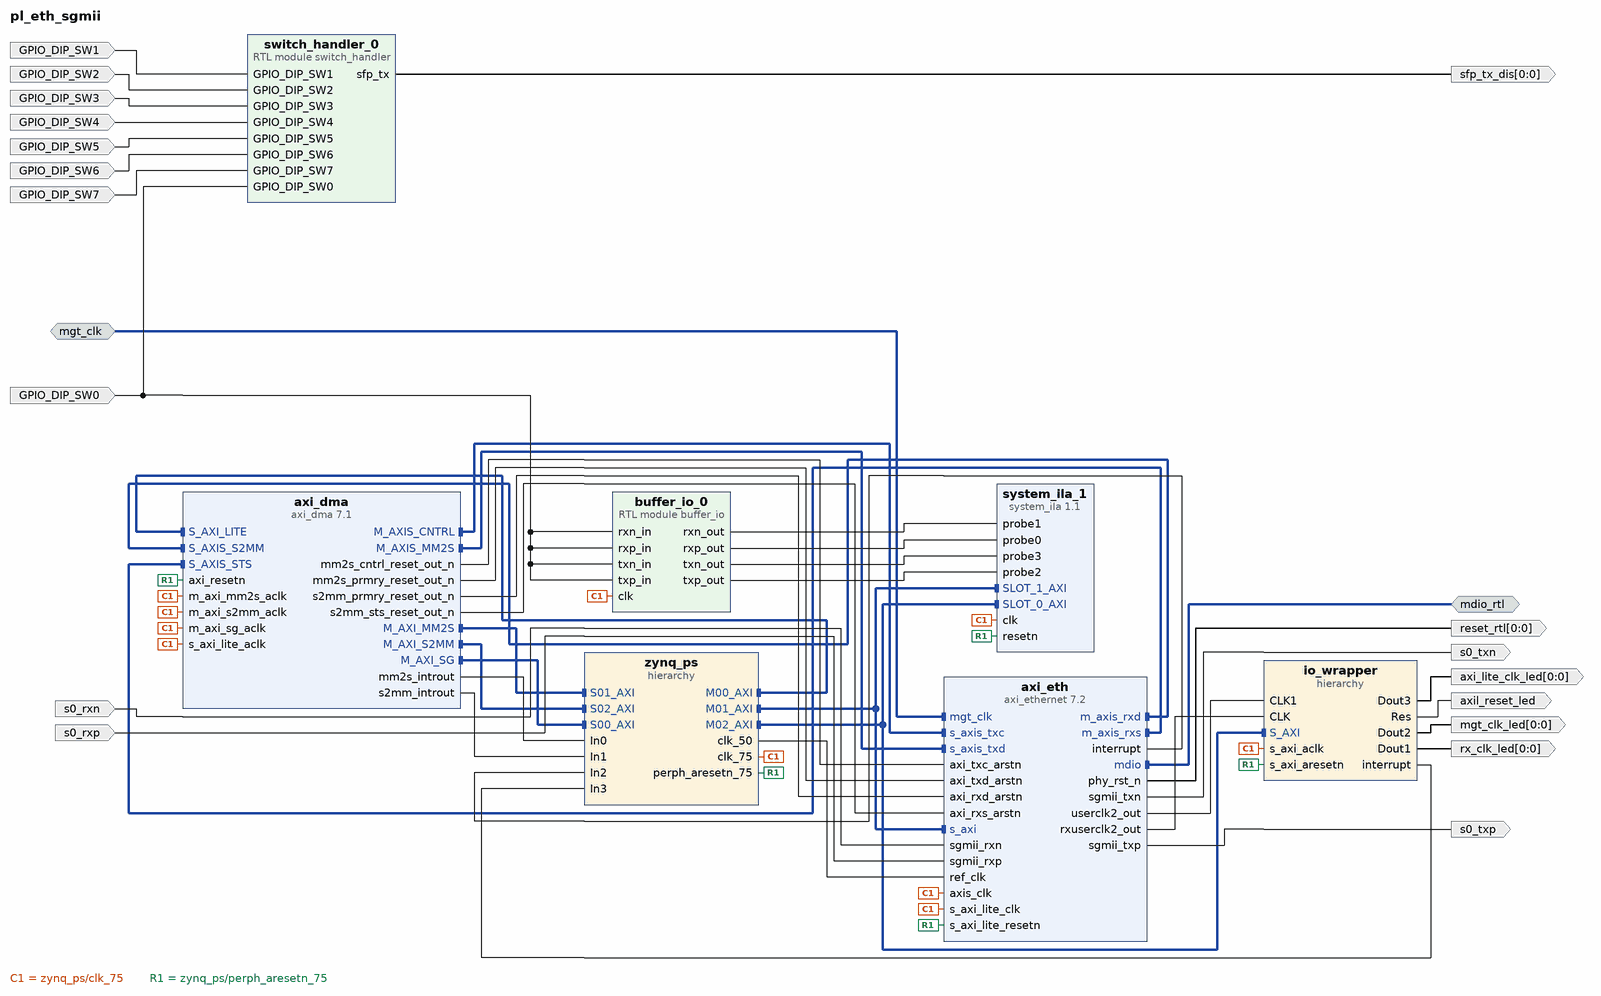
[diagram p0: block diagram of the top level]
# Vivado block design pl_eth_sgmii, xczu9eg-ffvb1156-2-e, Vivado 2022.1
create_bd_design pl_eth_sgmii

create_bd_intf_port -mode Master -vlnv xilinx.com:interface:mdio_rtl:1.0 mdio_rtl
create_bd_intf_port -mode Slave -vlnv xilinx.com:interface:diff_clock_rtl:1.0 mgt_clk
create_bd_port -dir I GPIO_DIP_SW0
create_bd_port -dir I GPIO_DIP_SW1
create_bd_port -dir I GPIO_DIP_SW2
create_bd_port -dir I GPIO_DIP_SW3
create_bd_port -dir I GPIO_DIP_SW4
create_bd_port -dir I GPIO_DIP_SW5
create_bd_port -dir I GPIO_DIP_SW6
create_bd_port -dir I GPIO_DIP_SW7
create_bd_port -dir O -from 0 -to 0 axi_lite_clk_led
create_bd_port -dir O axil_reset_led
create_bd_port -dir O -from 0 -to 0 mgt_clk_led
create_bd_port -dir O -from 0 -to 0 -type rst reset_rtl
create_bd_port -dir O -from 0 -to 0 rx_clk_led
create_bd_port -dir I s0_rxn
create_bd_port -dir I s0_rxp
create_bd_port -dir O s0_txn
create_bd_port -dir O s0_txp
create_bd_port -dir O -from 0 -to 0 sfp_tx_dis

create_bd_cell -type ip -vlnv xilinx.com:ip:axi_dma:7.1 axi_dma
set_property -dict [list \
  CONFIG.c_include_mm2s_dre 1 \
  CONFIG.c_include_s2mm_dre 1 \
  CONFIG.c_sg_length_width 16 \
  CONFIG.c_sg_use_stsapp_length 1 \
] [get_bd_cells axi_dma]
create_bd_cell -type ip -vlnv xilinx.com:ip:axi_ethernet:7.2 axi_eth
set_property -dict [list \
  CONFIG.ENABLE_LVDS false \
  CONFIG.Enable_1588 false \
  CONFIG.PHYADDR 2 \
  CONFIG.PHY_TYPE SGMII \
  CONFIG.RXCSUM Full \
  CONFIG.RXMEM 32k \
  CONFIG.Statistics_Reset true \
  CONFIG.SupportLevel 1 \
  CONFIG.TXCSUM Full \
  CONFIG.TXMEM 32k \
  CONFIG.TransceiverControl false \
  CONFIG.gtlocation X1Y12 \
  CONFIG.gtrefclkrate 156.25 \
  CONFIG.speed_1_2p5 1G \
] [get_bd_cells axi_eth]
create_bd_cell -type module -reference buffer_io buffer_io_0
create_bd_cell -type hier io_wrapper
create_bd_cell -type module -reference switch_handler switch_handler_0
create_bd_cell -type ip -vlnv xilinx.com:ip:system_ila:1.1 system_ila_1
set_property -dict {CONFIG.C_MON_TYPE MIX CONFIG.C_NUM_MONITOR_SLOTS 2 CONFIG.C_NUM_OF_PROBES 4} [get_bd_cells system_ila_1]
create_bd_cell -type hier zynq_ps

# ---- hierarchy /io_wrapper ----
current_bd_instance /io_wrapper
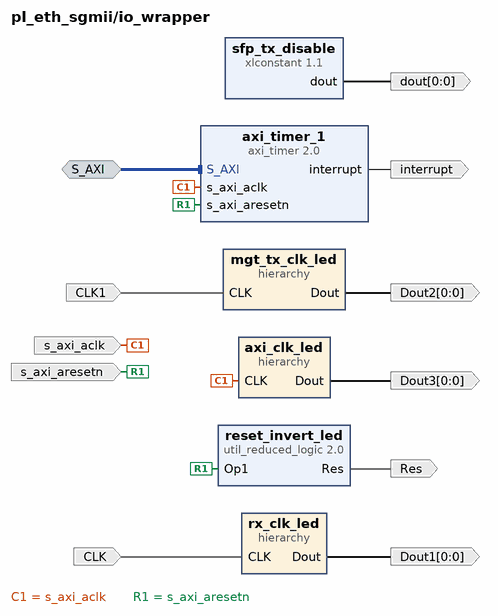
[diagram p1: block diagram inside /io_wrapper]
create_bd_intf_pin -mode Slave -vlnv xilinx.com:interface:aximm_rtl:1.0 S_AXI
create_bd_pin -dir I -type clk CLK
create_bd_pin -dir I -type clk CLK1
create_bd_pin -dir O -from 0 -to 0 Dout1
create_bd_pin -dir O -from 0 -to 0 Dout2
create_bd_pin -dir O -from 0 -to 0 Dout3
create_bd_pin -dir O Res
create_bd_pin -dir O -from 0 -to 0 dout
create_bd_pin -dir O -type intr interrupt
create_bd_pin -dir I -type clk s_axi_aclk
create_bd_pin -dir I -type rst s_axi_aresetn

create_bd_cell -type hier axi_clk_led
create_bd_cell -type ip -vlnv xilinx.com:ip:axi_timer:2.0 axi_timer_1
create_bd_cell -type hier mgt_tx_clk_led
create_bd_cell -type ip -vlnv xilinx.com:ip:util_reduced_logic:2.0 reset_invert_led
set_property -dict {CONFIG.C_SIZE 1} [get_bd_cells reset_invert_led]
create_bd_cell -type hier rx_clk_led
create_bd_cell -type ip -vlnv xilinx.com:ip:xlconstant:1.1 sfp_tx_disable
set_property -dict {CONFIG.CONST_VAL 1 CONFIG.CONST_WIDTH 1} [get_bd_cells sfp_tx_disable]

# ---- hierarchy /io_wrapper/axi_clk_led ----
current_bd_instance /io_wrapper/axi_clk_led
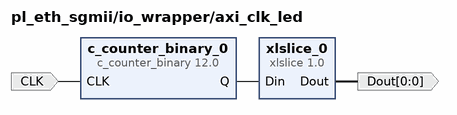
[diagram p2: block diagram inside /io_wrapper/axi_clk_led]
create_bd_pin -dir I -type clk CLK
create_bd_pin -dir O -from 0 -to 0 Dout

create_bd_cell -type ip -vlnv xilinx.com:ip:c_counter_binary:12.0 c_counter_binary_0
set_property -dict {CONFIG.Output_Width 32 CONFIG.Restrict_Count false} [get_bd_cells c_counter_binary_0]
create_bd_cell -type ip -vlnv xilinx.com:ip:xlslice:1.0 xlslice_0
set_property -dict {CONFIG.DIN_FROM 24 CONFIG.DIN_TO 24 CONFIG.DOUT_WIDTH 1} [get_bd_cells xlslice_0]

# ---- hierarchy /io_wrapper/mgt_tx_clk_led ----
current_bd_instance /io_wrapper/mgt_tx_clk_led
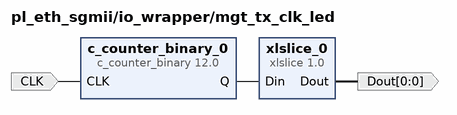
[diagram p3: block diagram inside /io_wrapper/mgt_tx_clk_led]
create_bd_pin -dir I -type clk CLK
create_bd_pin -dir O -from 0 -to 0 Dout

create_bd_cell -type ip -vlnv xilinx.com:ip:c_counter_binary:12.0 c_counter_binary_0
set_property -dict {CONFIG.Output_Width 32 CONFIG.Restrict_Count false} [get_bd_cells c_counter_binary_0]
create_bd_cell -type ip -vlnv xilinx.com:ip:xlslice:1.0 xlslice_0
set_property -dict {CONFIG.DIN_FROM 24 CONFIG.DIN_TO 24 CONFIG.DOUT_WIDTH 1} [get_bd_cells xlslice_0]

# ---- hierarchy /io_wrapper/rx_clk_led ----
current_bd_instance /io_wrapper/rx_clk_led
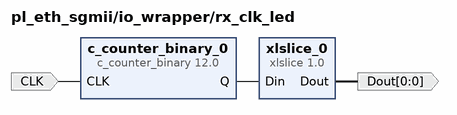
[diagram p4: block diagram inside /io_wrapper/rx_clk_led]
create_bd_pin -dir I -type clk CLK
create_bd_pin -dir O -from 0 -to 0 Dout

create_bd_cell -type ip -vlnv xilinx.com:ip:c_counter_binary:12.0 c_counter_binary_0
set_property -dict {CONFIG.Output_Width 32 CONFIG.Restrict_Count false} [get_bd_cells c_counter_binary_0]
create_bd_cell -type ip -vlnv xilinx.com:ip:xlslice:1.0 xlslice_0
set_property -dict {CONFIG.DIN_FROM 24 CONFIG.DIN_TO 24 CONFIG.DOUT_WIDTH 1} [get_bd_cells xlslice_0]

# ---- hierarchy /zynq_ps ----
current_bd_instance /zynq_ps
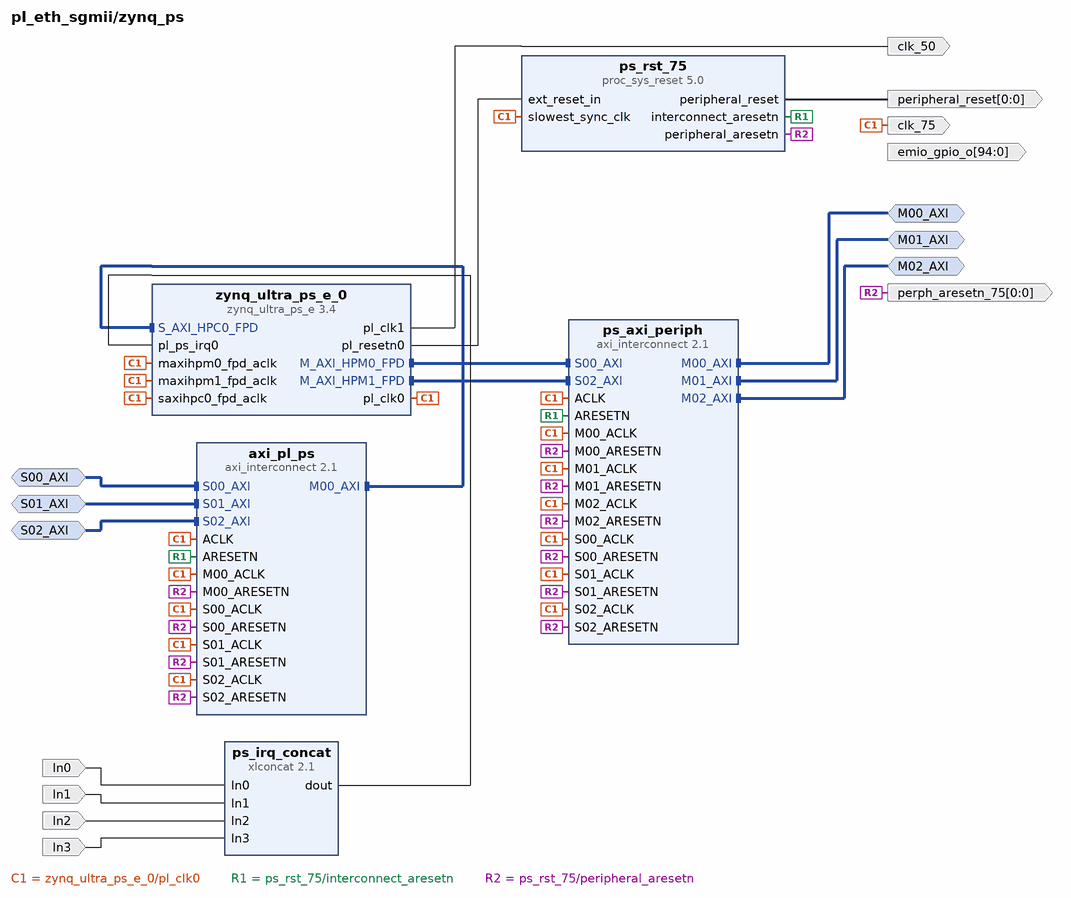
[diagram p5: block diagram inside /zynq_ps]
create_bd_intf_pin -mode Master -vlnv xilinx.com:interface:aximm_rtl:1.0 M00_AXI
create_bd_intf_pin -mode Master -vlnv xilinx.com:interface:aximm_rtl:1.0 M01_AXI
create_bd_intf_pin -mode Master -vlnv xilinx.com:interface:aximm_rtl:1.0 M02_AXI
create_bd_intf_pin -mode Slave -vlnv xilinx.com:interface:aximm_rtl:1.0 S00_AXI
create_bd_intf_pin -mode Slave -vlnv xilinx.com:interface:aximm_rtl:1.0 S01_AXI
create_bd_intf_pin -mode Slave -vlnv xilinx.com:interface:aximm_rtl:1.0 S02_AXI
create_bd_pin -dir I In0
create_bd_pin -dir I In1
create_bd_pin -dir I In2
create_bd_pin -dir I In3
create_bd_pin -dir O -type clk clk_50
create_bd_pin -dir O -type clk clk_75
create_bd_pin -dir O -from 94 -to 0 emio_gpio_o
create_bd_pin -dir O -from 0 -to 0 -type rst peripheral_reset
create_bd_pin -dir O -from 0 -to 0 -type rst perph_aresetn_75

create_bd_cell -type ip -vlnv xilinx.com:ip:axi_interconnect:2.1 axi_pl_ps
set_property -dict [list \
  CONFIG.ENABLE_ADVANCED_OPTIONS 1 \
  CONFIG.NUM_MI 1 \
  CONFIG.NUM_SI 3 \
  CONFIG.XBAR_DATA_WIDTH 32 \
] [get_bd_cells axi_pl_ps]
create_bd_cell -type ip -vlnv xilinx.com:ip:axi_interconnect:2.1 ps_axi_periph
set_property -dict {CONFIG.NUM_MI 3 CONFIG.NUM_SI 3} [get_bd_cells ps_axi_periph]
create_bd_cell -type ip -vlnv xilinx.com:ip:xlconcat:2.1 ps_irq_concat
set_property -dict {CONFIG.NUM_PORTS 4} [get_bd_cells ps_irq_concat]
create_bd_cell -type ip -vlnv xilinx.com:ip:proc_sys_reset:5.0 ps_rst_75
create_bd_cell -type ip -vlnv xilinx.com:ip:zynq_ultra_ps_e:3.4 zynq_ultra_ps_e_0
set_property -dict [list \
  CONFIG.PSU_BANK_0_IO_STANDARD LVCMOS18 \
  CONFIG.PSU_BANK_1_IO_STANDARD LVCMOS18 \
  CONFIG.PSU_BANK_2_IO_STANDARD LVCMOS18 \
  CONFIG.PSU_BANK_3_IO_STANDARD LVCMOS18 \
  CONFIG.PSU_DYNAMIC_DDR_CONFIG_EN 1 \
  CONFIG.PSU_USB3__DUAL_CLOCK_ENABLE 1 \
  CONFIG.PSU__CAN1__PERIPHERAL__ENABLE 1 \
  CONFIG.PSU__CAN1__PERIPHERAL__IO {MIO 24 .. 25} \
  CONFIG.PSU__CRF_APB__ACPU_CTRL__FREQMHZ 1200 \
  CONFIG.PSU__CRF_APB__ACPU_CTRL__SRCSEL APLL \
  CONFIG.PSU__CRF_APB__APLL_CTRL__SRCSEL PSS_REF_CLK \
  CONFIG.PSU__CRF_APB__DBG_FPD_CTRL__FREQMHZ 250 \
  CONFIG.PSU__CRF_APB__DBG_FPD_CTRL__SRCSEL IOPLL \
  CONFIG.PSU__CRF_APB__DBG_TRACE_CTRL__FREQMHZ 250 \
  CONFIG.PSU__CRF_APB__DBG_TRACE_CTRL__SRCSEL IOPLL \
  CONFIG.PSU__CRF_APB__DBG_TSTMP_CTRL__FREQMHZ 250 \
  CONFIG.PSU__CRF_APB__DBG_TSTMP_CTRL__SRCSEL IOPLL \
  CONFIG.PSU__CRF_APB__DDR_CTRL__FREQMHZ 1067 \
  CONFIG.PSU__CRF_APB__DDR_CTRL__SRCSEL DPLL \
  CONFIG.PSU__CRF_APB__DPDMA_REF_CTRL__FREQMHZ 600 \
  CONFIG.PSU__CRF_APB__DPDMA_REF_CTRL__SRCSEL APLL \
  CONFIG.PSU__CRF_APB__DPLL_CTRL__SRCSEL PSS_REF_CLK \
  CONFIG.PSU__CRF_APB__DP_AUDIO_REF_CTRL__SRCSEL RPLL \
  CONFIG.PSU__CRF_APB__DP_STC_REF_CTRL__SRCSEL RPLL \
  CONFIG.PSU__CRF_APB__DP_VIDEO_REF_CTRL__SRCSEL VPLL \
  CONFIG.PSU__CRF_APB__GDMA_REF_CTRL__FREQMHZ 600 \
  CONFIG.PSU__CRF_APB__GDMA_REF_CTRL__SRCSEL APLL \
  CONFIG.PSU__CRF_APB__GPU_REF_CTRL__FREQMHZ 500 \
  CONFIG.PSU__CRF_APB__GPU_REF_CTRL__SRCSEL IOPLL \
  CONFIG.PSU__CRF_APB__TOPSW_LSBUS_CTRL__FREQMHZ 100 \
  CONFIG.PSU__CRF_APB__TOPSW_LSBUS_CTRL__SRCSEL IOPLL \
  CONFIG.PSU__CRF_APB__TOPSW_MAIN_CTRL__FREQMHZ 533.33 \
  CONFIG.PSU__CRF_APB__TOPSW_MAIN_CTRL__SRCSEL DPLL \
  CONFIG.PSU__CRF_APB__VPLL_CTRL__SRCSEL PSS_REF_CLK \
  CONFIG.PSU__CRL_APB__ADMA_REF_CTRL__FREQMHZ 500 \
  CONFIG.PSU__CRL_APB__ADMA_REF_CTRL__SRCSEL IOPLL \
  CONFIG.PSU__CRL_APB__CAN1_REF_CTRL__FREQMHZ 100 \
  CONFIG.PSU__CRL_APB__CAN1_REF_CTRL__SRCSEL IOPLL \
  CONFIG.PSU__CRL_APB__CPU_R5_CTRL__FREQMHZ 500 \
  CONFIG.PSU__CRL_APB__CPU_R5_CTRL__SRCSEL IOPLL \
  CONFIG.PSU__CRL_APB__DBG_LPD_CTRL__FREQMHZ 250 \
  CONFIG.PSU__CRL_APB__DBG_LPD_CTRL__SRCSEL IOPLL \
  CONFIG.PSU__CRL_APB__GEM3_REF_CTRL__FREQMHZ 125 \
  CONFIG.PSU__CRL_APB__GEM3_REF_CTRL__SRCSEL IOPLL \
  CONFIG.PSU__CRL_APB__I2C0_REF_CTRL__FREQMHZ 100 \
  CONFIG.PSU__CRL_APB__I2C0_REF_CTRL__SRCSEL IOPLL \
  CONFIG.PSU__CRL_APB__I2C1_REF_CTRL__FREQMHZ 100 \
  CONFIG.PSU__CRL_APB__I2C1_REF_CTRL__SRCSEL IOPLL \
  CONFIG.PSU__CRL_APB__IOPLL_CTRL__SRCSEL PSS_REF_CLK \
  CONFIG.PSU__CRL_APB__IOU_SWITCH_CTRL__FREQMHZ 250 \
  CONFIG.PSU__CRL_APB__IOU_SWITCH_CTRL__SRCSEL IOPLL \
  CONFIG.PSU__CRL_APB__LPD_LSBUS_CTRL__FREQMHZ 100 \
  CONFIG.PSU__CRL_APB__LPD_LSBUS_CTRL__SRCSEL IOPLL \
  CONFIG.PSU__CRL_APB__LPD_SWITCH_CTRL__FREQMHZ 500 \
  CONFIG.PSU__CRL_APB__LPD_SWITCH_CTRL__SRCSEL IOPLL \
  CONFIG.PSU__CRL_APB__PCAP_CTRL__FREQMHZ 200 \
  CONFIG.PSU__CRL_APB__PCAP_CTRL__SRCSEL IOPLL \
  CONFIG.PSU__CRL_APB__PL0_REF_CTRL__FREQMHZ 100 \
  CONFIG.PSU__CRL_APB__PL0_REF_CTRL__SRCSEL IOPLL \
  CONFIG.PSU__CRL_APB__PL1_REF_CTRL__FREQMHZ 50 \
  CONFIG.PSU__CRL_APB__QSPI_REF_CTRL__FREQMHZ 125 \
  CONFIG.PSU__CRL_APB__QSPI_REF_CTRL__SRCSEL IOPLL \
  CONFIG.PSU__CRL_APB__RPLL_CTRL__SRCSEL PSS_REF_CLK \
  CONFIG.PSU__CRL_APB__SDIO1_REF_CTRL__FREQMHZ 200 \
  CONFIG.PSU__CRL_APB__SDIO1_REF_CTRL__SRCSEL IOPLL \
  CONFIG.PSU__CRL_APB__TIMESTAMP_REF_CTRL__FREQMHZ 100 \
  CONFIG.PSU__CRL_APB__TIMESTAMP_REF_CTRL__SRCSEL IOPLL \
  CONFIG.PSU__CRL_APB__UART0_REF_CTRL__FREQMHZ 100 \
  CONFIG.PSU__CRL_APB__UART0_REF_CTRL__SRCSEL IOPLL \
  CONFIG.PSU__CRL_APB__UART1_REF_CTRL__FREQMHZ 100 \
  CONFIG.PSU__CRL_APB__UART1_REF_CTRL__SRCSEL IOPLL \
  CONFIG.PSU__CRL_APB__USB0_BUS_REF_CTRL__FREQMHZ 250 \
  CONFIG.PSU__CRL_APB__USB0_BUS_REF_CTRL__SRCSEL IOPLL \
  CONFIG.PSU__CRL_APB__USB3_DUAL_REF_CTRL__FREQMHZ 20 \
  CONFIG.PSU__CRL_APB__USB3_DUAL_REF_CTRL__SRCSEL IOPLL \
  CONFIG.PSU__CRL_APB__USB3__ENABLE 1 \
  CONFIG.PSU__CSUPMU__PERIPHERAL__VALID 1 \
  CONFIG.PSU__DDRC__BUS_WIDTH {64 Bit} \
  CONFIG.PSU__DDRC__COMPONENTS UDIMM \
  CONFIG.PSU__DDRC__DEVICE_CAPACITY {4096 MBits} \
  CONFIG.PSU__DDRC__DRAM_WIDTH {8 Bits} \
  CONFIG.PSU__DDRC__ECC Disabled \
  CONFIG.PSU__DDRC__MEMORY_TYPE {DDR 4} \
  CONFIG.PSU__DDRC__SPEED_BIN DDR4_2133P \
  CONFIG.PSU__DDR_HIGH_ADDRESS_GUI_ENABLE 1 \
  CONFIG.PSU__DDR__INTERFACE__FREQMHZ 533.500 \
  CONFIG.PSU__DISPLAYPORT__LANE0__ENABLE 1 \
  CONFIG.PSU__DISPLAYPORT__LANE0__IO {GT Lane1} \
  CONFIG.PSU__DISPLAYPORT__LANE1__ENABLE 0 \
  CONFIG.PSU__DISPLAYPORT__PERIPHERAL__ENABLE 1 \
  CONFIG.PSU__DLL__ISUSED 1 \
  CONFIG.PSU__DPAUX__PERIPHERAL__ENABLE 1 \
  CONFIG.PSU__DPAUX__PERIPHERAL__IO {MIO 27 .. 30} \
  CONFIG.PSU__DP__LANE_SEL {Single Lower} \
  CONFIG.PSU__DP__REF_CLK_FREQ 27 \
  CONFIG.PSU__DP__REF_CLK_SEL {Ref Clk3} \
  CONFIG.PSU__ENET3__FIFO__ENABLE 0 \
  CONFIG.PSU__ENET3__GRP_MDIO__ENABLE 1 \
  CONFIG.PSU__ENET3__GRP_MDIO__IO {MIO 76 .. 77} \
  CONFIG.PSU__ENET3__PERIPHERAL__ENABLE 1 \
  CONFIG.PSU__ENET3__PERIPHERAL__IO {MIO 64 .. 75} \
  CONFIG.PSU__ENET3__PTP__ENABLE 0 \
  CONFIG.PSU__ENET3__TSU__ENABLE 0 \
  CONFIG.PSU__FPGA_PL0_ENABLE 1 \
  CONFIG.PSU__FPGA_PL1_ENABLE 1 \
  CONFIG.PSU__GEM3_COHERENCY 0 \
  CONFIG.PSU__GEM3_ROUTE_THROUGH_FPD 0 \
  CONFIG.PSU__GEM__TSU__ENABLE 0 \
  CONFIG.PSU__GPIO0_MIO__IO {MIO 0 .. 25} \
  CONFIG.PSU__GPIO0_MIO__PERIPHERAL__ENABLE 1 \
  CONFIG.PSU__GPIO1_MIO__IO {MIO 26 .. 51} \
  CONFIG.PSU__GPIO1_MIO__PERIPHERAL__ENABLE 1 \
  CONFIG.PSU__GT__LINK_SPEED HBR \
  CONFIG.PSU__GT__PRE_EMPH_LVL_4 0 \
  CONFIG.PSU__GT__VLT_SWNG_LVL_4 0 \
  CONFIG.PSU__I2C0__PERIPHERAL__ENABLE 1 \
  CONFIG.PSU__I2C0__PERIPHERAL__IO {MIO 14 .. 15} \
  CONFIG.PSU__I2C1__PERIPHERAL__ENABLE 1 \
  CONFIG.PSU__I2C1__PERIPHERAL__IO {MIO 16 .. 17} \
  CONFIG.PSU__IOU_SLCR__IOU_TTC_APB_CLK__TTC0_SEL APB \
  CONFIG.PSU__IOU_SLCR__IOU_TTC_APB_CLK__TTC1_SEL APB \
  CONFIG.PSU__IOU_SLCR__IOU_TTC_APB_CLK__TTC2_SEL APB \
  CONFIG.PSU__IOU_SLCR__IOU_TTC_APB_CLK__TTC3_SEL APB \
  CONFIG.PSU__MAXIGP0__DATA_WIDTH 128 \
  CONFIG.PSU__OVERRIDE__BASIC_CLOCK 0 \
  CONFIG.PSU__PCIE__BAR0_VAL 0x0 \
  CONFIG.PSU__PCIE__BAR1_VAL 0x0 \
  CONFIG.PSU__PCIE__BAR2_VAL 0x0 \
  CONFIG.PSU__PCIE__BAR3_VAL 0x0 \
  CONFIG.PSU__PCIE__BAR4_VAL 0x0 \
  CONFIG.PSU__PCIE__BAR5_VAL 0x0 \
  CONFIG.PSU__PCIE__CLASS_CODE_BASE 0x06 \
  CONFIG.PSU__PCIE__CLASS_CODE_INTERFACE 0x0 \
  CONFIG.PSU__PCIE__CLASS_CODE_SUB 0x4 \
  CONFIG.PSU__PCIE__CLASS_CODE_VALUE 0x60400 \
  CONFIG.PSU__PCIE__CRS_SW_VISIBILITY 1 \
  CONFIG.PSU__PCIE__DEVICE_ID 0xD021 \
  CONFIG.PSU__PCIE__DEVICE_PORT_TYPE {Root Port} \
  CONFIG.PSU__PCIE__EROM_VAL 0x0 \
  CONFIG.PSU__PCIE__LANE0__ENABLE 1 \
  CONFIG.PSU__PCIE__LANE0__IO {GT Lane0} \
  CONFIG.PSU__PCIE__LINK_SPEED {5.0 Gb/s} \
  CONFIG.PSU__PCIE__MAXIMUM_LINK_WIDTH x1 \
  CONFIG.PSU__PCIE__MAX_PAYLOAD_SIZE {256 bytes} \
  CONFIG.PSU__PCIE__PERIPHERAL__ENABLE 1 \
  CONFIG.PSU__PCIE__PERIPHERAL__ENDPOINT_ENABLE 0 \
  CONFIG.PSU__PCIE__PERIPHERAL__ROOTPORT_ENABLE 1 \
  CONFIG.PSU__PCIE__PERIPHERAL__ROOTPORT_IO {MIO 31} \
  CONFIG.PSU__PCIE__REF_CLK_FREQ 100 \
  CONFIG.PSU__PCIE__REF_CLK_SEL {Ref Clk0} \
  CONFIG.PSU__PCIE__REVISION_ID 0x0 \
  CONFIG.PSU__PCIE__SUBSYSTEM_ID 0x7 \
  CONFIG.PSU__PCIE__SUBSYSTEM_VENDOR_ID 0x10EE \
  CONFIG.PSU__PCIE__VENDOR_ID 0x10EE \
  CONFIG.PSU__PMU_COHERENCY 0 \
  CONFIG.PSU__PMU__AIBACK__ENABLE 0 \
  CONFIG.PSU__PMU__EMIO_GPI__ENABLE 0 \
  CONFIG.PSU__PMU__EMIO_GPO__ENABLE 0 \
  CONFIG.PSU__PMU__GPI0__ENABLE 0 \
  CONFIG.PSU__PMU__GPI1__ENABLE 0 \
  CONFIG.PSU__PMU__GPI2__ENABLE 0 \
  CONFIG.PSU__PMU__GPI3__ENABLE 0 \
  CONFIG.PSU__PMU__GPI4__ENABLE 0 \
  CONFIG.PSU__PMU__GPI5__ENABLE 0 \
  CONFIG.PSU__PMU__GPO0__ENABLE 0 \
  CONFIG.PSU__PMU__GPO1__ENABLE 0 \
  CONFIG.PSU__PMU__GPO2__ENABLE 1 \
  CONFIG.PSU__PMU__GPO2__IO {MIO 34} \
  CONFIG.PSU__PMU__GPO2__POLARITY high \
  CONFIG.PSU__PMU__GPO3__ENABLE 0 \
  CONFIG.PSU__PMU__GPO4__ENABLE 0 \
  CONFIG.PSU__PMU__GPO5__ENABLE 0 \
  CONFIG.PSU__PMU__PERIPHERAL__ENABLE 1 \
  CONFIG.PSU__PMU__PLERROR__ENABLE 0 \
  CONFIG.PSU__PRESET_APPLIED 1 \
  CONFIG.PSU__PSS_REF_CLK__FREQMHZ 33.330 \
  CONFIG.PSU__QSPI_COHERENCY 0 \
  CONFIG.PSU__QSPI_ROUTE_THROUGH_FPD 0 \
  CONFIG.PSU__QSPI__GRP_FBCLK__ENABLE 1 \
  CONFIG.PSU__QSPI__GRP_FBCLK__IO {MIO 6} \
  CONFIG.PSU__QSPI__PERIPHERAL__DATA_MODE x4 \
  CONFIG.PSU__QSPI__PERIPHERAL__ENABLE 1 \
  CONFIG.PSU__QSPI__PERIPHERAL__IO {MIO 0 .. 12} \
  CONFIG.PSU__QSPI__PERIPHERAL__MODE {Dual Parallel} \
  CONFIG.PSU__SATA__LANE1__IO {GT Lane3} \
  CONFIG.PSU__SATA__PERIPHERAL__ENABLE 1 \
  CONFIG.PSU__SATA__REF_CLK_FREQ 125 \
  CONFIG.PSU__SATA__REF_CLK_SEL {Ref Clk1} \
  CONFIG.PSU__SD1_COHERENCY 0 \
  CONFIG.PSU__SD1_ROUTE_THROUGH_FPD 0 \
  CONFIG.PSU__SD1__CLK_100_SDR_OTAP_DLY 0x3 \
  CONFIG.PSU__SD1__CLK_200_SDR_OTAP_DLY 0x3 \
  CONFIG.PSU__SD1__CLK_50_DDR_ITAP_DLY 0x3D \
  CONFIG.PSU__SD1__CLK_50_DDR_OTAP_DLY 0x4 \
  CONFIG.PSU__SD1__CLK_50_SDR_ITAP_DLY 0x15 \
  CONFIG.PSU__SD1__CLK_50_SDR_OTAP_DLY 0x5 \
  CONFIG.PSU__SD1__DATA_TRANSFER_MODE 8Bit \
  CONFIG.PSU__SD1__GRP_CD__ENABLE 1 \
  CONFIG.PSU__SD1__GRP_CD__IO {MIO 45} \
  CONFIG.PSU__SD1__GRP_POW__ENABLE 0 \
  CONFIG.PSU__SD1__GRP_WP__ENABLE 1 \
  CONFIG.PSU__SD1__GRP_WP__IO {MIO 44} \
  CONFIG.PSU__SD1__PERIPHERAL__ENABLE 1 \
  CONFIG.PSU__SD1__PERIPHERAL__IO {MIO 39 .. 51} \
  CONFIG.PSU__SD1__SLOT_TYPE {SD 3.0} \
  CONFIG.PSU__SWDT0__CLOCK__ENABLE 0 \
  CONFIG.PSU__SWDT0__PERIPHERAL__ENABLE 1 \
  CONFIG.PSU__SWDT0__RESET__ENABLE 0 \
  CONFIG.PSU__SWDT1__CLOCK__ENABLE 0 \
  CONFIG.PSU__SWDT1__PERIPHERAL__ENABLE 1 \
  CONFIG.PSU__SWDT1__RESET__ENABLE 0 \
  CONFIG.PSU__TSU__BUFG_PORT_PAIR 0 \
  CONFIG.PSU__TTC0__CLOCK__ENABLE 0 \
  CONFIG.PSU__TTC0__PERIPHERAL__ENABLE 1 \
  CONFIG.PSU__TTC0__WAVEOUT__ENABLE 0 \
  CONFIG.PSU__TTC1__CLOCK__ENABLE 0 \
  CONFIG.PSU__TTC1__PERIPHERAL__ENABLE 1 \
  CONFIG.PSU__TTC1__WAVEOUT__ENABLE 0 \
  CONFIG.PSU__TTC2__CLOCK__ENABLE 0 \
  CONFIG.PSU__TTC2__PERIPHERAL__ENABLE 1 \
  CONFIG.PSU__TTC2__WAVEOUT__ENABLE 0 \
  CONFIG.PSU__TTC3__CLOCK__ENABLE 0 \
  CONFIG.PSU__TTC3__PERIPHERAL__ENABLE 1 \
  CONFIG.PSU__TTC3__WAVEOUT__ENABLE 0 \
  CONFIG.PSU__UART0__BAUD_RATE 115200 \
  CONFIG.PSU__UART0__MODEM__ENABLE 0 \
  CONFIG.PSU__UART0__PERIPHERAL__ENABLE 1 \
  CONFIG.PSU__UART0__PERIPHERAL__IO {MIO 18 .. 19} \
  CONFIG.PSU__UART1__BAUD_RATE 115200 \
  CONFIG.PSU__UART1__MODEM__ENABLE 0 \
  CONFIG.PSU__UART1__PERIPHERAL__ENABLE 1 \
  CONFIG.PSU__UART1__PERIPHERAL__IO {MIO 20 .. 21} \
  CONFIG.PSU__USB0_COHERENCY 0 \
  CONFIG.PSU__USB0__PERIPHERAL__ENABLE 1 \
  CONFIG.PSU__USB0__PERIPHERAL__IO {MIO 52 .. 63} \
  CONFIG.PSU__USB0__REF_CLK_FREQ 26 \
  CONFIG.PSU__USB0__REF_CLK_SEL {Ref Clk2} \
  CONFIG.PSU__USB2_0__EMIO__ENABLE 0 \
  CONFIG.PSU__USB3_0__EMIO__ENABLE 0 \
  CONFIG.PSU__USB3_0__PERIPHERAL__ENABLE 1 \
  CONFIG.PSU__USB3_0__PERIPHERAL__IO {GT Lane2} \
  CONFIG.PSU__USB__RESET__MODE {Boot Pin} \
  CONFIG.PSU__USB__RESET__POLARITY {Active Low} \
  CONFIG.PSU__USE__IRQ0 1 \
  CONFIG.PSU__USE__M_AXI_GP0 1 \
  CONFIG.PSU__USE__M_AXI_GP1 1 \
  CONFIG.PSU__USE__M_AXI_GP2 0 \
  CONFIG.PSU__USE__S_AXI_GP0 1 \
] [get_bd_cells zynq_ultra_ps_e_0]
# 117 more settings of zynq_ultra_ps_e_0 are not shown: defaults, MIO pin electricals, DDR timing, and values the tool derives

# ---- connections ----

current_bd_instance /io_wrapper
connect_bd_intf_net [get_bd_intf_pins S_AXI] [get_bd_intf_pins axi_timer_1/S_AXI]
connect_bd_net -net CLK1_1 [get_bd_pins CLK1] [get_bd_pins mgt_tx_clk_led/CLK]
connect_bd_net [get_bd_pins CLK] [get_bd_pins rx_clk_led/CLK]
connect_bd_net [get_bd_pins axi_clk_led/Dout] [get_bd_pins Dout3]
connect_bd_net [get_bd_pins axi_timer_1/interrupt] [get_bd_pins interrupt]
connect_bd_net [get_bd_pins mgt_tx_clk_led/Dout] [get_bd_pins Dout2]
connect_bd_net [get_bd_pins reset_invert_led/Res] [get_bd_pins Res]
connect_bd_net [get_bd_pins rx_clk_led/Dout] [get_bd_pins Dout1]
connect_bd_net [get_bd_pins s_axi_aclk] [get_bd_pins axi_clk_led/CLK] [get_bd_pins axi_timer_1/s_axi_aclk]
connect_bd_net [get_bd_pins s_axi_aresetn] [get_bd_pins axi_timer_1/s_axi_aresetn] [get_bd_pins reset_invert_led/Op1]
connect_bd_net [get_bd_pins sfp_tx_disable/dout] [get_bd_pins dout]

current_bd_instance /io_wrapper/axi_clk_led
connect_bd_net [get_bd_pins CLK] [get_bd_pins c_counter_binary_0/CLK]
connect_bd_net [get_bd_pins c_counter_binary_0/Q] [get_bd_pins xlslice_0/Din]
connect_bd_net [get_bd_pins xlslice_0/Dout] [get_bd_pins Dout]

current_bd_instance /io_wrapper/mgt_tx_clk_led
connect_bd_net [get_bd_pins CLK] [get_bd_pins c_counter_binary_0/CLK]
connect_bd_net [get_bd_pins c_counter_binary_0/Q] [get_bd_pins xlslice_0/Din]
connect_bd_net [get_bd_pins xlslice_0/Dout] [get_bd_pins Dout]

current_bd_instance /io_wrapper/rx_clk_led
connect_bd_net [get_bd_pins CLK] [get_bd_pins c_counter_binary_0/CLK]
connect_bd_net [get_bd_pins c_counter_binary_0/Q] [get_bd_pins xlslice_0/Din]
connect_bd_net [get_bd_pins xlslice_0/Dout] [get_bd_pins Dout]

current_bd_instance /zynq_ps
connect_bd_intf_net [get_bd_intf_pins S00_AXI] [get_bd_intf_pins axi_pl_ps/S00_AXI]
connect_bd_intf_net [get_bd_intf_pins S01_AXI] [get_bd_intf_pins axi_pl_ps/S01_AXI]
connect_bd_intf_net [get_bd_intf_pins S02_AXI] [get_bd_intf_pins axi_pl_ps/S02_AXI]
connect_bd_intf_net [get_bd_intf_pins axi_pl_ps/M00_AXI] [get_bd_intf_pins zynq_ultra_ps_e_0/S_AXI_HPC0_FPD]
connect_bd_intf_net [get_bd_intf_pins M00_AXI] [get_bd_intf_pins ps_axi_periph/M00_AXI]
connect_bd_intf_net [get_bd_intf_pins M01_AXI] [get_bd_intf_pins ps_axi_periph/M01_AXI]
connect_bd_intf_net [get_bd_intf_pins M02_AXI] [get_bd_intf_pins ps_axi_periph/M02_AXI]
connect_bd_intf_net [get_bd_intf_pins zynq_ultra_ps_e_0/M_AXI_HPM0_FPD] [get_bd_intf_pins ps_axi_periph/S00_AXI]
connect_bd_intf_net [get_bd_intf_pins zynq_ultra_ps_e_0/M_AXI_HPM1_FPD] [get_bd_intf_pins ps_axi_periph/S02_AXI]
connect_bd_net -net ACLK_1 [get_bd_pins zynq_ultra_ps_e_0/pl_clk0] \
  [get_bd_pins clk_75] [get_bd_pins axi_pl_ps/ACLK] [get_bd_pins axi_pl_ps/M00_ACLK] [get_bd_pins axi_pl_ps/S00_ACLK] \
  [get_bd_pins axi_pl_ps/S01_ACLK] [get_bd_pins axi_pl_ps/S02_ACLK] [get_bd_pins ps_axi_periph/ACLK] \
  [get_bd_pins ps_axi_periph/M00_ACLK] [get_bd_pins ps_axi_periph/M01_ACLK] [get_bd_pins ps_axi_periph/M02_ACLK] \
  [get_bd_pins ps_axi_periph/S00_ACLK] [get_bd_pins ps_axi_periph/S01_ACLK] [get_bd_pins ps_rst_75/slowest_sync_clk] \
  [get_bd_pins zynq_ultra_ps_e_0/saxihpc0_fpd_aclk] [get_bd_pins zynq_ultra_ps_e_0/maxihpm1_fpd_aclk] \
  [get_bd_pins zynq_ultra_ps_e_0/maxihpm0_fpd_aclk] [get_bd_pins ps_axi_periph/S02_ACLK]
connect_bd_net -net ARESETN_1 [get_bd_pins ps_rst_75/interconnect_aresetn] [get_bd_pins axi_pl_ps/ARESETN] [get_bd_pins ps_axi_periph/ARESETN]
connect_bd_net -net In0_1 [get_bd_pins In0] [get_bd_pins ps_irq_concat/In0]
connect_bd_net -net In1_1 [get_bd_pins In1] [get_bd_pins ps_irq_concat/In1]
connect_bd_net -net In2_1 [get_bd_pins In2] [get_bd_pins ps_irq_concat/In2]
connect_bd_net -net In3_1 [get_bd_pins In3] [get_bd_pins ps_irq_concat/In3]
connect_bd_net -net M00_ARESETN_1 [get_bd_pins ps_rst_75/peripheral_aresetn] \
  [get_bd_pins perph_aresetn_75] [get_bd_pins axi_pl_ps/M00_ARESETN] [get_bd_pins axi_pl_ps/S00_ARESETN] \
  [get_bd_pins axi_pl_ps/S01_ARESETN] [get_bd_pins axi_pl_ps/S02_ARESETN] [get_bd_pins ps_axi_periph/M00_ARESETN] \
  [get_bd_pins ps_axi_periph/M01_ARESETN] [get_bd_pins ps_axi_periph/M02_ARESETN] [get_bd_pins ps_axi_periph/S00_ARESETN] \
  [get_bd_pins ps_axi_periph/S01_ARESETN] [get_bd_pins ps_axi_periph/S02_ARESETN]
connect_bd_net [get_bd_pins ps_irq_concat/dout] [get_bd_pins zynq_ultra_ps_e_0/pl_ps_irq0]
connect_bd_net [get_bd_pins ps_rst_75/peripheral_reset] [get_bd_pins peripheral_reset]
connect_bd_net [get_bd_pins zynq_ultra_ps_e_0/pl_clk1] [get_bd_pins clk_50]
connect_bd_net [get_bd_pins zynq_ultra_ps_e_0/pl_resetn0] [get_bd_pins ps_rst_75/ext_reset_in]

current_bd_instance /
connect_bd_intf_net [get_bd_intf_pins io_wrapper/S_AXI] [get_bd_intf_pins zynq_ps/M02_AXI]
connect_bd_intf_net [get_bd_intf_pins io_wrapper/S_AXI] [get_bd_intf_pins system_ila_1/SLOT_0_AXI]
connect_bd_intf_net -intf_net axi_eth_0_dma_M_AXIS_CNTRL [get_bd_intf_pins axi_dma/M_AXIS_CNTRL] [get_bd_intf_pins axi_eth/s_axis_txc]
connect_bd_intf_net -intf_net axi_eth_0_dma_M_AXIS_MM2S [get_bd_intf_pins axi_dma/M_AXIS_MM2S] [get_bd_intf_pins axi_eth/s_axis_txd]
connect_bd_intf_net -intf_net axi_eth_0_dma_M_AXI_MM2S [get_bd_intf_pins axi_dma/M_AXI_MM2S] [get_bd_intf_pins zynq_ps/S01_AXI]
connect_bd_intf_net -intf_net axi_eth_0_dma_M_AXI_S2MM [get_bd_intf_pins axi_dma/M_AXI_S2MM] [get_bd_intf_pins zynq_ps/S02_AXI]
connect_bd_intf_net -intf_net axi_eth_0_dma_M_AXI_SG [get_bd_intf_pins axi_dma/M_AXI_SG] [get_bd_intf_pins zynq_ps/S00_AXI]
connect_bd_intf_net -intf_net axi_eth_0_m_axis_rxd [get_bd_intf_pins axi_dma/S_AXIS_S2MM] [get_bd_intf_pins axi_eth/m_axis_rxd]
connect_bd_intf_net -intf_net axi_eth_0_m_axis_rxs [get_bd_intf_pins axi_dma/S_AXIS_STS] [get_bd_intf_pins axi_eth/m_axis_rxs]
connect_bd_intf_net [get_bd_intf_ports mdio_rtl] [get_bd_intf_pins axi_eth/mdio]
connect_bd_intf_net -intf_net mgt_clk_0_1 [get_bd_intf_ports mgt_clk] [get_bd_intf_pins axi_eth/mgt_clk]
connect_bd_intf_net [get_bd_intf_pins axi_dma/S_AXI_LITE] [get_bd_intf_pins zynq_ps/M00_AXI]
connect_bd_intf_net [get_bd_intf_pins axi_eth/s_axi] [get_bd_intf_pins zynq_ps/M01_AXI]
connect_bd_intf_net [get_bd_intf_pins axi_eth/s_axi] [get_bd_intf_pins system_ila_1/SLOT_1_AXI]
connect_bd_net -net CLK1_1 [get_bd_pins axi_eth/userclk2_out] [get_bd_pins io_wrapper/CLK1]
connect_bd_net -net GPIO_DIP_SW0_0_1 [get_bd_ports GPIO_DIP_SW0] \
  [get_bd_pins buffer_io_0/rxn_in] [get_bd_pins buffer_io_0/rxp_in] [get_bd_pins buffer_io_0/txn_in] \
  [get_bd_pins buffer_io_0/txp_in] [get_bd_pins switch_handler_0/GPIO_DIP_SW0]
connect_bd_net -net GPIO_DIP_SW1_0_1 [get_bd_ports GPIO_DIP_SW1] [get_bd_pins switch_handler_0/GPIO_DIP_SW1]
connect_bd_net -net GPIO_DIP_SW2_0_1 [get_bd_ports GPIO_DIP_SW2] [get_bd_pins switch_handler_0/GPIO_DIP_SW2]
connect_bd_net -net GPIO_DIP_SW3_0_1 [get_bd_ports GPIO_DIP_SW3] [get_bd_pins switch_handler_0/GPIO_DIP_SW3]
connect_bd_net -net GPIO_DIP_SW4_0_1 [get_bd_ports GPIO_DIP_SW4] [get_bd_pins switch_handler_0/GPIO_DIP_SW4]
connect_bd_net -net GPIO_DIP_SW5_0_1 [get_bd_ports GPIO_DIP_SW5] [get_bd_pins switch_handler_0/GPIO_DIP_SW5]
connect_bd_net -net GPIO_DIP_SW6_0_1 [get_bd_ports GPIO_DIP_SW6] [get_bd_pins switch_handler_0/GPIO_DIP_SW6]
connect_bd_net -net GPIO_DIP_SW7_0_1 [get_bd_ports GPIO_DIP_SW7] [get_bd_pins switch_handler_0/GPIO_DIP_SW7]
connect_bd_net -net In2_1 [get_bd_pins axi_eth/interrupt] [get_bd_pins zynq_ps/In2]
connect_bd_net -net axi_eth_0_dma_mm2s_cntrl_reset_out_n [get_bd_pins axi_dma/mm2s_cntrl_reset_out_n] [get_bd_pins axi_eth/axi_txc_arstn]
connect_bd_net -net axi_eth_0_dma_mm2s_introut [get_bd_pins axi_dma/mm2s_introut] [get_bd_pins zynq_ps/In0]
connect_bd_net -net axi_eth_0_dma_mm2s_prmry_reset_out_n [get_bd_pins axi_dma/mm2s_prmry_reset_out_n] [get_bd_pins axi_eth/axi_txd_arstn]
connect_bd_net -net axi_eth_0_dma_s2mm_introut [get_bd_pins axi_dma/s2mm_introut] [get_bd_pins zynq_ps/In1]
connect_bd_net -net axi_eth_0_dma_s2mm_prmry_reset_out_n [get_bd_pins axi_dma/s2mm_prmry_reset_out_n] [get_bd_pins axi_eth/axi_rxd_arstn]
connect_bd_net -net axi_eth_0_dma_s2mm_sts_reset_out_n [get_bd_pins axi_dma/s2mm_sts_reset_out_n] [get_bd_pins axi_eth/axi_rxs_arstn]
connect_bd_net -net axi_eth_0_rxuserclk2_out [get_bd_pins axi_eth/rxuserclk2_out] [get_bd_pins io_wrapper/CLK]
connect_bd_net [get_bd_pins axi_eth/phy_rst_n] [get_bd_ports reset_rtl]
connect_bd_net [get_bd_pins axi_eth/sgmii_txn] [get_bd_ports s0_txn]
connect_bd_net [get_bd_pins axi_eth/sgmii_txp] [get_bd_ports s0_txp]
connect_bd_net [get_bd_pins buffer_io_0/rxn_out] [get_bd_pins system_ila_1/probe1]
connect_bd_net [get_bd_pins buffer_io_0/rxp_out] [get_bd_pins system_ila_1/probe0]
connect_bd_net [get_bd_pins buffer_io_0/txn_out] [get_bd_pins system_ila_1/probe3]
connect_bd_net [get_bd_pins buffer_io_0/txp_out] [get_bd_pins system_ila_1/probe2]
connect_bd_net -net other_perph_Dout1 [get_bd_pins io_wrapper/Dout1] [get_bd_ports rx_clk_led]
connect_bd_net -net other_perph_Dout2 [get_bd_pins io_wrapper/Dout2] [get_bd_ports mgt_clk_led]
connect_bd_net -net other_perph_Dout3 [get_bd_pins io_wrapper/Dout3] [get_bd_ports axi_lite_clk_led]
connect_bd_net -net other_perph_Res [get_bd_pins io_wrapper/Res] [get_bd_ports axil_reset_led]
connect_bd_net -net other_perph_interrupt [get_bd_pins io_wrapper/interrupt] [get_bd_pins zynq_ps/In3]
connect_bd_net [get_bd_ports s0_rxn] [get_bd_pins axi_eth/sgmii_rxn]
connect_bd_net [get_bd_ports s0_rxp] [get_bd_pins axi_eth/sgmii_rxp]
connect_bd_net -net s_axi_aclk_1 [get_bd_pins zynq_ps/clk_75] \
  [get_bd_pins axi_dma/m_axi_mm2s_aclk] [get_bd_pins axi_dma/m_axi_s2mm_aclk] [get_bd_pins axi_dma/m_axi_sg_aclk] \
  [get_bd_pins axi_dma/s_axi_lite_aclk] [get_bd_pins axi_eth/axis_clk] [get_bd_pins axi_eth/s_axi_lite_clk] \
  [get_bd_pins buffer_io_0/clk] [get_bd_pins io_wrapper/s_axi_aclk] [get_bd_pins system_ila_1/clk]
connect_bd_net -net s_axi_aresetn_1 [get_bd_pins zynq_ps/perph_aresetn_75] \
  [get_bd_pins axi_dma/axi_resetn] [get_bd_pins axi_eth/s_axi_lite_resetn] [get_bd_pins io_wrapper/s_axi_aresetn] \
  [get_bd_pins system_ila_1/resetn]
connect_bd_net [get_bd_pins switch_handler_0/sfp_tx] [get_bd_ports sfp_tx_dis]
connect_bd_net [get_bd_pins zynq_ps/clk_50] [get_bd_pins axi_eth/ref_clk]

# ---- address map ----
assign_bd_address -offset 0x00000000 -range 2G -target_address_space [get_bd_addr_spaces axi_dma/Data_MM2S] [get_bd_addr_segs zynq_ps/zynq_ultra_ps_e_0/SAXIGP0/HPC0_DDR_LOW]
assign_bd_address -offset 0xC0000000 -range 256M -target_address_space [get_bd_addr_spaces axi_dma/Data_MM2S] [get_bd_addr_segs zynq_ps/zynq_ultra_ps_e_0/SAXIGP0/HPC0_QSPI]
assign_bd_address -offset 0xE0000000 -range 128M -target_address_space [get_bd_addr_spaces axi_dma/Data_MM2S] [get_bd_addr_segs zynq_ps/zynq_ultra_ps_e_0/SAXIGP0/HPC0_PCIE_LOW]
exclude_bd_addr_seg -offset 0x00000000 -range 1 -target_address_space [get_bd_addr_spaces axi_dma/Data_MM2S] [get_bd_addr_segs zynq_ps/zynq_ultra_ps_e_0/SAXIGP0/HPC0_DDR_HIGH]
exclude_bd_addr_seg -offset 0xFF000000 -range 16M -target_address_space [get_bd_addr_spaces axi_dma/Data_MM2S] [get_bd_addr_segs zynq_ps/zynq_ultra_ps_e_0/SAXIGP0/HPC0_LPS_OCM]
assign_bd_address -offset 0x00000000 -range 2G -target_address_space [get_bd_addr_spaces axi_dma/Data_S2MM] [get_bd_addr_segs zynq_ps/zynq_ultra_ps_e_0/SAXIGP0/HPC0_DDR_LOW]
assign_bd_address -offset 0xC0000000 -range 256M -target_address_space [get_bd_addr_spaces axi_dma/Data_S2MM] [get_bd_addr_segs zynq_ps/zynq_ultra_ps_e_0/SAXIGP0/HPC0_QSPI]
assign_bd_address -offset 0xE0000000 -range 128M -target_address_space [get_bd_addr_spaces axi_dma/Data_S2MM] [get_bd_addr_segs zynq_ps/zynq_ultra_ps_e_0/SAXIGP0/HPC0_PCIE_LOW]
exclude_bd_addr_seg -offset 0x00000000 -range 1 -target_address_space [get_bd_addr_spaces axi_dma/Data_S2MM] [get_bd_addr_segs zynq_ps/zynq_ultra_ps_e_0/SAXIGP0/HPC0_DDR_HIGH]
exclude_bd_addr_seg -offset 0xFF000000 -range 16M -target_address_space [get_bd_addr_spaces axi_dma/Data_S2MM] [get_bd_addr_segs zynq_ps/zynq_ultra_ps_e_0/SAXIGP0/HPC0_LPS_OCM]
assign_bd_address -offset 0x00000000 -range 2G -target_address_space [get_bd_addr_spaces axi_dma/Data_SG] [get_bd_addr_segs zynq_ps/zynq_ultra_ps_e_0/SAXIGP0/HPC0_DDR_LOW]
assign_bd_address -offset 0xC0000000 -range 256M -target_address_space [get_bd_addr_spaces axi_dma/Data_SG] [get_bd_addr_segs zynq_ps/zynq_ultra_ps_e_0/SAXIGP0/HPC0_QSPI]
assign_bd_address -offset 0xE0000000 -range 128M -target_address_space [get_bd_addr_spaces axi_dma/Data_SG] [get_bd_addr_segs zynq_ps/zynq_ultra_ps_e_0/SAXIGP0/HPC0_PCIE_LOW]
exclude_bd_addr_seg -offset 0x00000000 -range 1 -target_address_space [get_bd_addr_spaces axi_dma/Data_SG] [get_bd_addr_segs zynq_ps/zynq_ultra_ps_e_0/SAXIGP0/HPC0_DDR_HIGH]
exclude_bd_addr_seg -offset 0xFF000000 -range 16M -target_address_space [get_bd_addr_spaces axi_dma/Data_SG] [get_bd_addr_segs zynq_ps/zynq_ultra_ps_e_0/SAXIGP0/HPC0_LPS_OCM]
assign_bd_address -offset 0x00A0000000 -range 64K -target_address_space [get_bd_addr_spaces zynq_ps/zynq_ultra_ps_e_0/Data] [get_bd_addr_segs axi_dma/S_AXI_LITE/Reg]
assign_bd_address -offset 0x00A0010000 -range 64K -target_address_space [get_bd_addr_spaces zynq_ps/zynq_ultra_ps_e_0/Data] [get_bd_addr_segs io_wrapper/axi_timer_1/S_AXI/Reg]
assign_bd_address -offset 0x00A0040000 -range 256K -target_address_space [get_bd_addr_spaces zynq_ps/zynq_ultra_ps_e_0/Data] [get_bd_addr_segs axi_eth/s_axi/Reg0]

set_property USER_COMMENTS.comment_2 {PL ETHERNET SGMII DESIGN} [current_bd_design]

validate_bd_design
save_bd_design
